# EAGLE design PCB-CMB-5-ETHERMEGA (EAGLE 7.3.0)

## Sheet 1 of 2
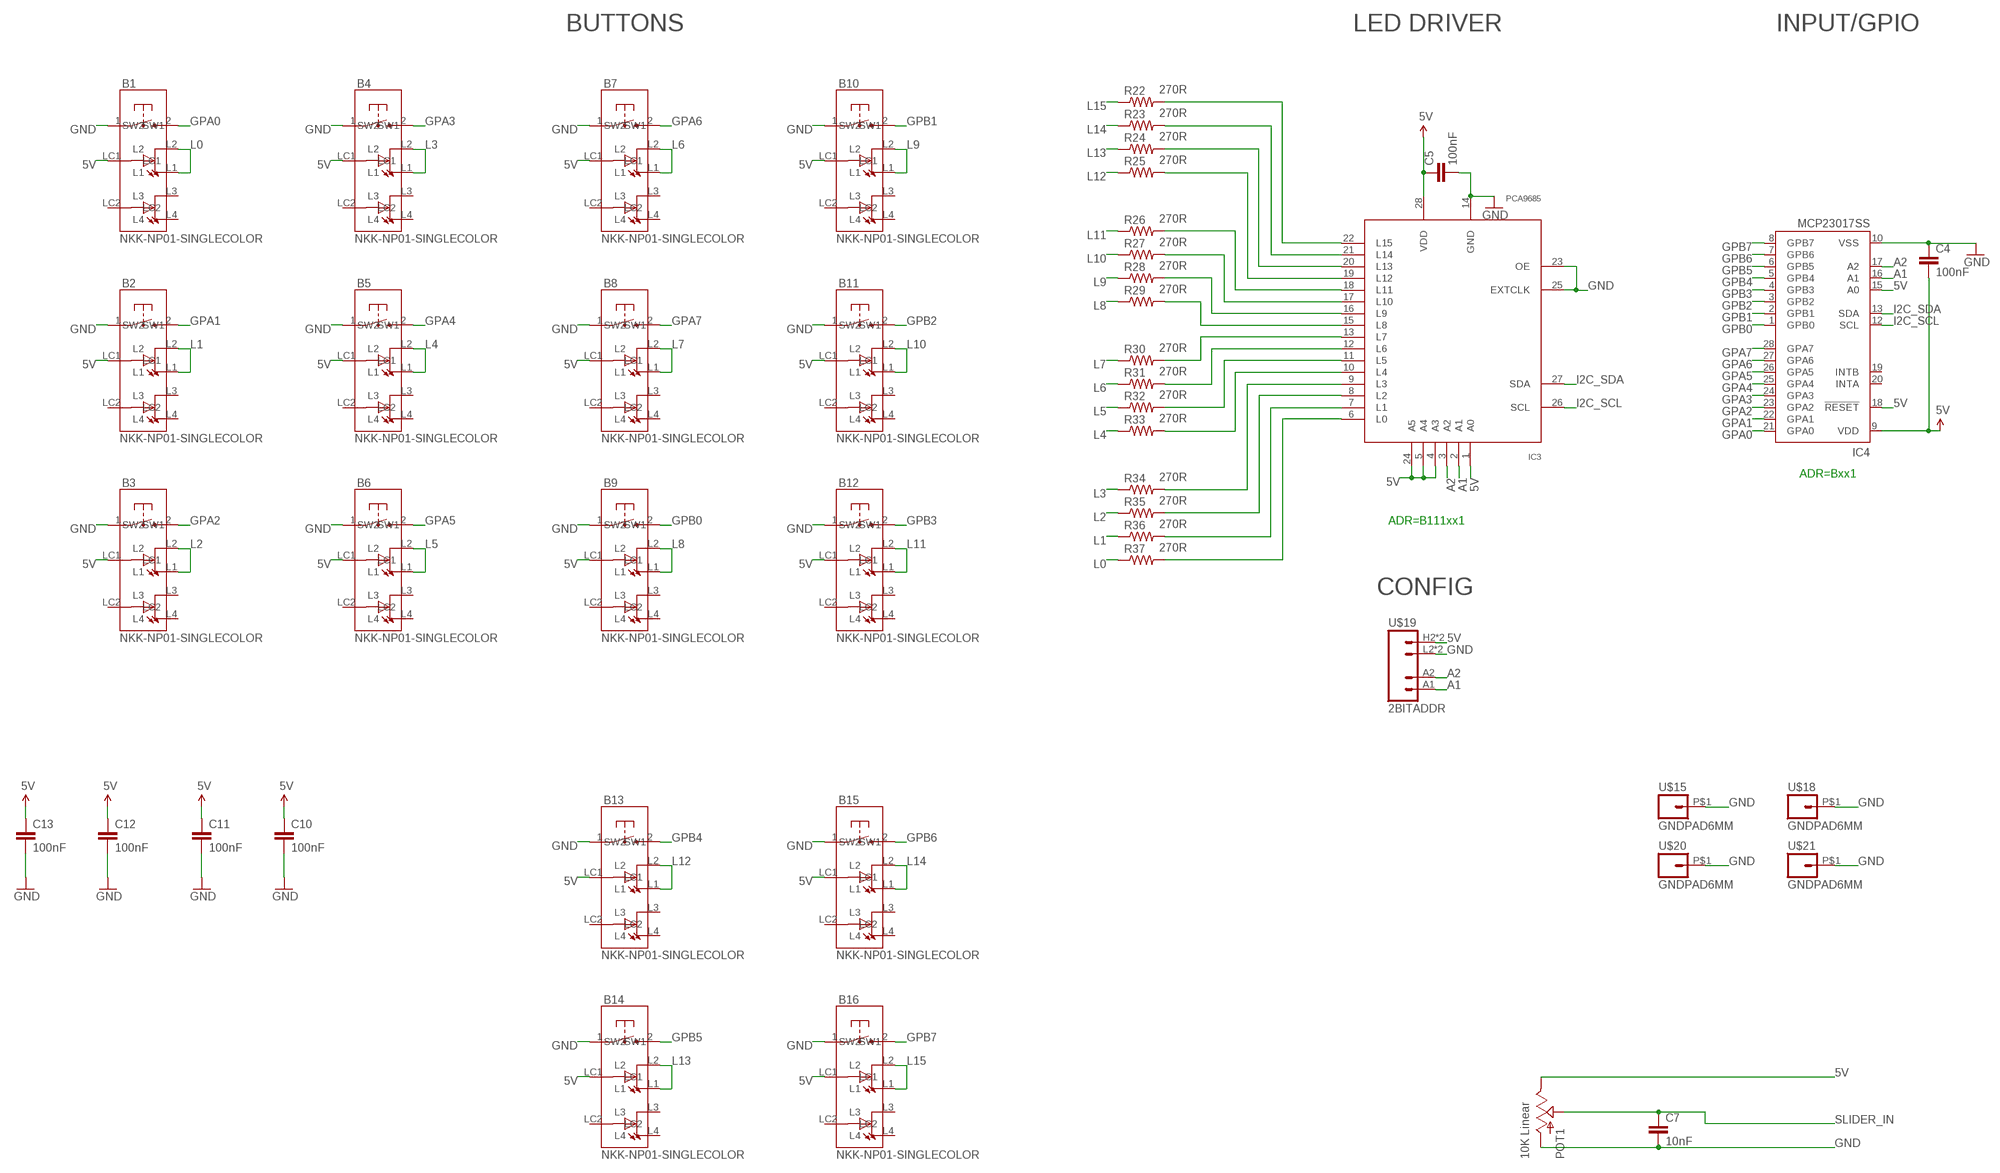
[diagram p0: schematic, sheet 1, part 1 of 2]
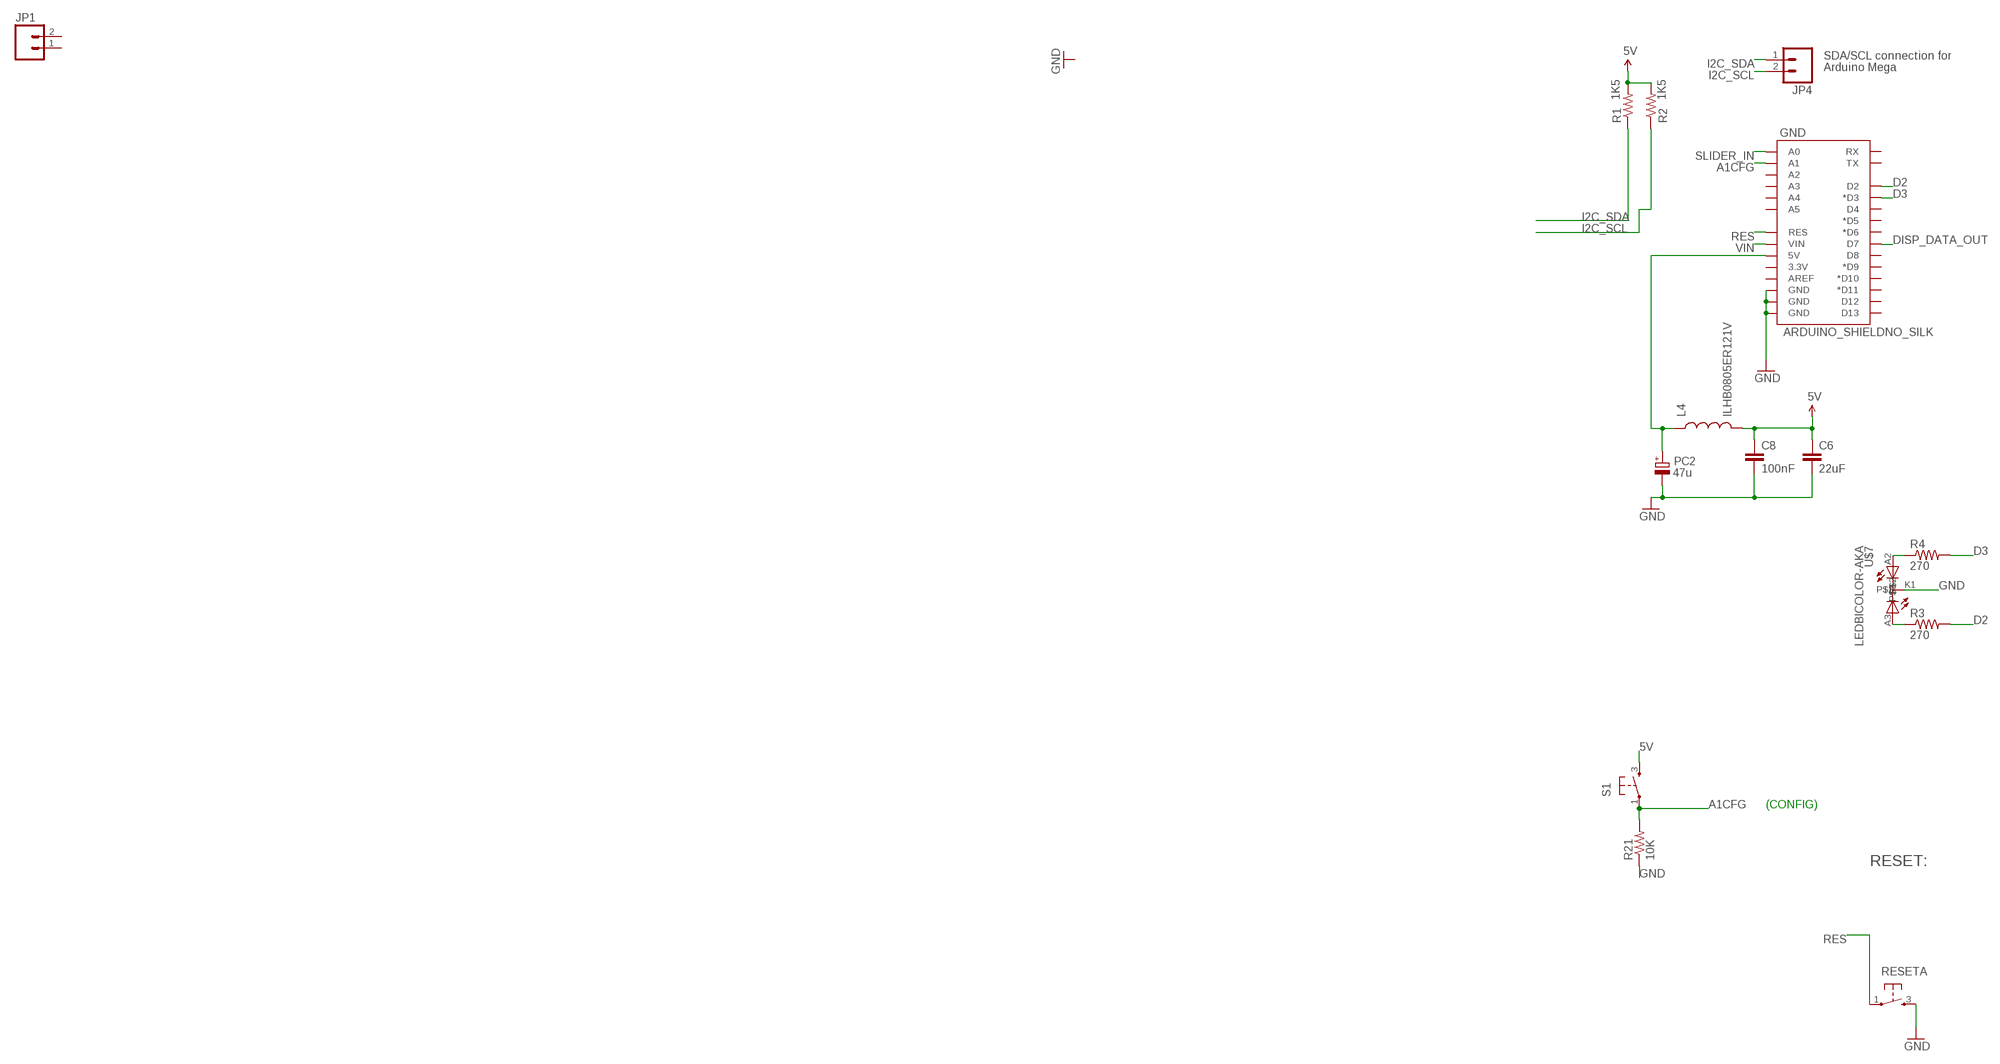
[diagram p1: schematic, sheet 1, part 2 of 2]

### Parts
B1  NKK-NP01-SINGLECOLOR  [NKK-NP01]
B2  NKK-NP01-SINGLECOLOR  [NKK-NP01]
B3  NKK-NP01-SINGLECOLOR  [NKK-NP01]
B4  NKK-NP01-SINGLECOLOR  [NKK-NP01]
B5  NKK-NP01-SINGLECOLOR  [NKK-NP01]
B6  NKK-NP01-SINGLECOLOR  [NKK-NP01]
B7  NKK-NP01-SINGLECOLOR  [NKK-NP01]
B8  NKK-NP01-SINGLECOLOR  [NKK-NP01]
B9  NKK-NP01-SINGLECOLOR  [NKK-NP01]
B10  NKK-NP01-SINGLECOLOR  [NKK-NP01]
B11  NKK-NP01-SINGLECOLOR  [NKK-NP01]
B12  NKK-NP01-SINGLECOLOR  [NKK-NP01]
B13  NKK-NP01-SINGLECOLOR  [NKK-NP01]
B14  NKK-NP01-SINGLECOLOR  [NKK-NP01]
B15  NKK-NP01-SINGLECOLOR  [NKK-NP01]
B16  NKK-NP01-SINGLECOLOR  [NKK-NP01]
C4  100nF  CAP0603-CAP  [0603-CAP]
C5  100nF  CAP0603-CAP  [0603-CAP]
C6  22uF  CAP0805  [0805]
C7  10nF  CAP0603-CAP  [0603-CAP]
C8  100nF  CAP0603-CAP  [0603-CAP]
C10  100nF  CAP0603-CAP  [0603-CAP]
C11  100nF  CAP0603-CAP  [0603-CAP]
C12  100nF  CAP0603-CAP  [0603-CAP]
C13  100nF  CAP0603-CAP  [0603-CAP]
GND  ARDUINO_SHIELDNO_SILK  [DUEMILANOVE_VIAS]
IC3  PCA9685  [TSSOP28]
IC4  MCP23017SS  [SSOP28]
JP1  M02PTH  [1X02]
JP4  M02PTH  [1X02]
L4  ILHB0805ER121V  INDUCTOR0805  [0805]
PC2  47u  CPOL-EUD  [PANASONIC_D]
POT1  10K Linear  SLIDER20  [SLIDER20]
R1  1K5  RESISTOR0603-RES  [0603-RES]
R2  1K5  RESISTOR0603-RES  [0603-RES]
R3  270  RESISTOR0603-RES  [0603-RES]
R4  270  RESISTOR0603-RES  [0603-RES]
R21  10K  RESISTOR0603-RES  [0603-RES]
R22  270R  RESISTOR0603-RES  [0603-RES]
R23  270R  RESISTOR0603-RES  [0603-RES]
R24  270R  RESISTOR0603-RES  [0603-RES]
R25  270R  RESISTOR0603-RES  [0603-RES]
R26  270R  RESISTOR0603-RES  [0603-RES]
R27  270R  RESISTOR0603-RES  [0603-RES]
R28  270R  RESISTOR0603-RES  [0603-RES]
R29  270R  RESISTOR0603-RES  [0603-RES]
R30  270R  RESISTOR0603-RES  [0603-RES]
R31  270R  RESISTOR0603-RES  [0603-RES]
R32  270R  RESISTOR0603-RES  [0603-RES]
R33  270R  RESISTOR0603-RES  [0603-RES]
R34  270R  RESISTOR0603-RES  [0603-RES]
R35  270R  RESISTOR0603-RES  [0603-RES]
R36  270R  RESISTOR0603-RES  [0603-RES]
R37  270R  RESISTOR0603-RES  [0603-RES]
RESETA  TAC_SWITCH  [PUSHBUTTON]
S1  TAC_SWITCH  [PUSHBUTTON]
U$7  LEDBICOLOR-AKA  [LED5MM-BICOLOR]
U$15  GNDPAD6MM  [3.2MMPAD6MM]
U$18  GNDPAD6MM  [3.2MMPAD6MM]
U$19  2BITADDR  [2BITADDR]
U$20  GNDPAD6MM  [3.2MMPAD6MM]
U$21  GNDPAD6MM  [3.2MMPAD6MM]

### Nets
5V [Power]: B1.LC1 B2.LC1 B3.LC1 B4.LC1 B5.LC1 B6.LC1 B7.LC1 B8.LC1 B9.LC1 B10.LC1 B11.LC1 B12.LC1 B13.LC1 B14.LC1 B15.LC1 B16.LC1 C4.2 C5.1 C6.1 C8.1 C10.1 C11.1 C12.1 C13.1 IC3.1(A0) IC3.4(A3) IC3.5(A4) IC3.24(A5) IC3.28(VDD) IC4.9(VDD) IC4.15(A0) IC4.18(!RESET) L4.2 POT1.1(E) R1.2 R2.2 S1.3 U$19.H2(VCC) U$19.H3(VCC)
A1: IC3.2(A1) IC4.16(A1) U$19.A1
A1CFG: GND.A1 R21.2 S1.1
A2: IC3.3(A2) IC4.17(A2) U$19.A2
ARD_5V [Power]: GND.5V L4.1 PC2.+
D2: GND.D2 R3.2
D3: GND.D3(*D3) R4.2
DISP_DATA_OUT: GND.D7
GND [Power]: B1.1(SW1) B2.1(SW1) B3.1(SW1) B4.1(SW1) B5.1(SW1) B6.1(SW1) B7.1(SW1) B8.1(SW1) B9.1(SW1) B10.1(SW1) B11.1(SW1) B12.1(SW1) B13.1(SW1) B14.1(SW1) B15.1(SW1) B16.1(SW1) C4.1 C5.2 C6.2 C7.2 C8.2 C10.2 C11.2 C12.2 C13.2 GND.GND@0(GND) GND.GND@1(GND) GND.GND@2(GND) IC3.14(GND) IC3.23(OE) IC3.25(EXTCLK) IC4.10(VSS) PC2.- POT1.3(A) R21.1 RESETA.3 U$7.K1 U$15.P$1 U$18.P$1 U$19.L2(GND) U$19.L3(GND) U$20.P$1 U$21.P$1
GPA0: B1.2(SW2) IC4.21(GPA0)
GPA1: B2.2(SW2) IC4.22(GPA1)
GPA2: B3.2(SW2) IC4.23(GPA2)
GPA3: B4.2(SW2) IC4.24(GPA3)
GPA4: B5.2(SW2) IC4.25(GPA4)
GPA5: B6.2(SW2) IC4.26(GPA5)
GPA6: B7.2(SW2) IC4.27(GPA6)
GPA7: B8.2(SW2) IC4.28(GPA7)
GPB0 [Power]: B9.2(SW2) IC4.1(GPB0)
GPB1: B10.2(SW2) IC4.2(GPB1)
GPB2: B11.2(SW2) IC4.3(GPB2)
GPB3: B12.2(SW2) IC4.4(GPB3)
GPB4: B13.2(SW2) IC4.5(GPB4)
GPB5: B14.2(SW2) IC4.6(GPB5)
GPB6: B15.2(SW2) IC4.7(GPB6)
GPB7: B16.2(SW2) IC4.8(GPB7)
I2C_SCL: IC3.26(SCL) IC4.12(SCL) JP4.2 R2.1
I2C_SDA: IC3.27(SDA) IC4.13(SDA) JP4.1 R1.1
L0: B1.L1 B1.L2 R37.1
L1: B2.L1 B2.L2 R36.1
L2: B3.L1 B3.L2 R35.1
L3: B4.L1 B4.L2 R34.1
L4: B5.L1 B5.L2 R33.1
L5: B6.L1 B6.L2 R32.1
L6: B7.L1 B7.L2 R31.1
L7: B8.L1 B8.L2 R30.1
L8: B9.L1 B9.L2 R29.1
L9: B10.L1 B10.L2 R28.1
L10: B11.L1 B11.L2 R27.1
L11: B12.L1 B12.L2 R26.1
L12: B13.L1 B13.L2 R25.1
L13: B14.L1 B14.L2 R24.1
L14: B15.L1 B15.L2 R23.1
L15: B16.L1 B16.L2 R22.1
N$2: IC3.13(L7) R30.2
N$7: R4.1 U$7.A2
N$11: R3.1 U$7.A3
N$19: IC3.12(L6) R31.2
N$23: IC3.11(L5) R32.2
N$31: IC3.10(L4) R33.2
N$58: IC3.9(L3) R34.2
N$59: IC3.8(L2) R35.2
N$67: IC3.7(L1) R36.2
N$74: IC3.6(L0) R37.2
N$75: IC3.15(L8) R29.2
N$76: IC3.16(L9) R28.2
N$77: IC3.17(L10) R27.2
N$78: IC3.18(L11) R26.2
N$79: IC3.19(L12) R25.2
N$80: IC3.20(L13) R24.2
N$81: IC3.21(L14) R23.2
N$82: IC3.22(L15) R22.2
RES: GND.RES RESETA.1
SLIDER_IN: C7.1 GND.A0 POT1.2A(S)
VIN: GND.VIN
Unconnected: B1.L3 B1.L4 B1.LC2 B2.L3 B2.L4 B2.LC2 B3.L3 B3.L4 B3.LC2 B4.L3 B4.L4 B4.LC2 B5.L3 B5.L4 B5.LC2 B6.L3 B6.L4 B6.LC2 B7.L3 B7.L4 B7.LC2 B8.L3 B8.L4 B8.LC2 B9.L3 B9.L4 B9.LC2 B10.L3 B10.L4 B10.LC2 B11.L3 B11.L4 B11.LC2 B12.L3 B12.L4 B12.LC2 B13.L3 B13.L4 B13.LC2 B14.L3 B14.L4 B14.LC2 B15.L3 B15.L4 B15.LC2 B16.L3 B16.L4 B16.LC2 GND.3.3V GND.A2 GND.A3 GND.A4 GND.A5 GND.AREF GND.D4 GND.D5(*D5) GND.D6(*D6) GND.D8 GND.D9(*D9) GND.D10(*D10) GND.D11(*D11) GND.D12 GND.D13 GND.RX GND.TX IC4.19(INTB) IC4.20(INTA) JP1.1 JP1.2

### Notes on the sheet
- BUTTONS | LED DRIVER | INPUT/GPIO
- ADR=Bxx1
- ADR=B111xx1
- CONFIG
- SDA/SCL connection for
- Arduino Mega
- (CONFIG)
- RESET:

## Sheet 2 of 2

## Library data of the parts
B1-B16 = SKAARHOJ:NKK-NP01-SINGLECOLOR
C4-C8 C10-C13 = SparkFun:CAP: Capacitor Standard 0603 ceramic capacitor, and 0.1" leaded capacitor.
GND = SparkFun:ARDUINO_SHIELD
IC3 = wsmith:PCA9685
IC4 = microchip:MCP23017: http://ww1.microchip.com/downloads/en/DeviceDoc/21952a.pdf Source: http://ww1.microchip.com/downloads/en/DeviceDoc/21952a.pdf; MF: MICROCHIP; MPN: MCP23017-E/SS; OC_FARNELL: 1467674; OC_NEWARK: 31K2960
JP1 JP4 = SparkFun:M02: Header 2 Standard 2-pin 0.1" header. Use with straight break away headers (SKU : PRT-00116), right angle break away headers (PRT-00553), swiss pins (PRT-00743), machine pins (PRT-00117), and female headers (PRT-00115). Molex polarized connector foot print use with SKU : PRT-08233 with associated crimp pins and housings.
L4 = SparkFun:INDUCTOR: Inductors Basic Inductor/Choke - 0603 and 1206. Footprints are not proven and vary greatly between part numbers.
PC2 = rcl:CPOL-EU: POLARIZED CAPACITOR, European symbol
POT1 = SKAARHOJ:SLIDER
R1-R4 R21-R37 = SparkFun:RESISTOR: Resistor Basic schematic elements and footprints for 0603, 1206, and PTH resistors.
RESETA S1 = SKAARHOJ:TAC_SWITCH: Momentary Switch Button commonly used for reset or general input. Spark Fun Electronics SKU : COM-00097
U$7 = SKAARHOJ:LEDBICOLOR-AKA
U$15 U$18 U$20 U$21 = SKAARHOJ:GNDPAD
U$19 = SKAARHOJ:2BITADDR

## Net classes
0 default: width 0.203 mm, drill 0.305 mm, clearance 0.203 mm
1 Power: width 0.406 mm, drill 0.457 mm, clearance 0.203 mm
2 RELAY LINES: width 0.305 mm, drill 0.305 mm, clearance 0.203 mm
3 INput lines: width 0.203 mm, drill 0.305 mm, clearance 0.203 mm

## Board
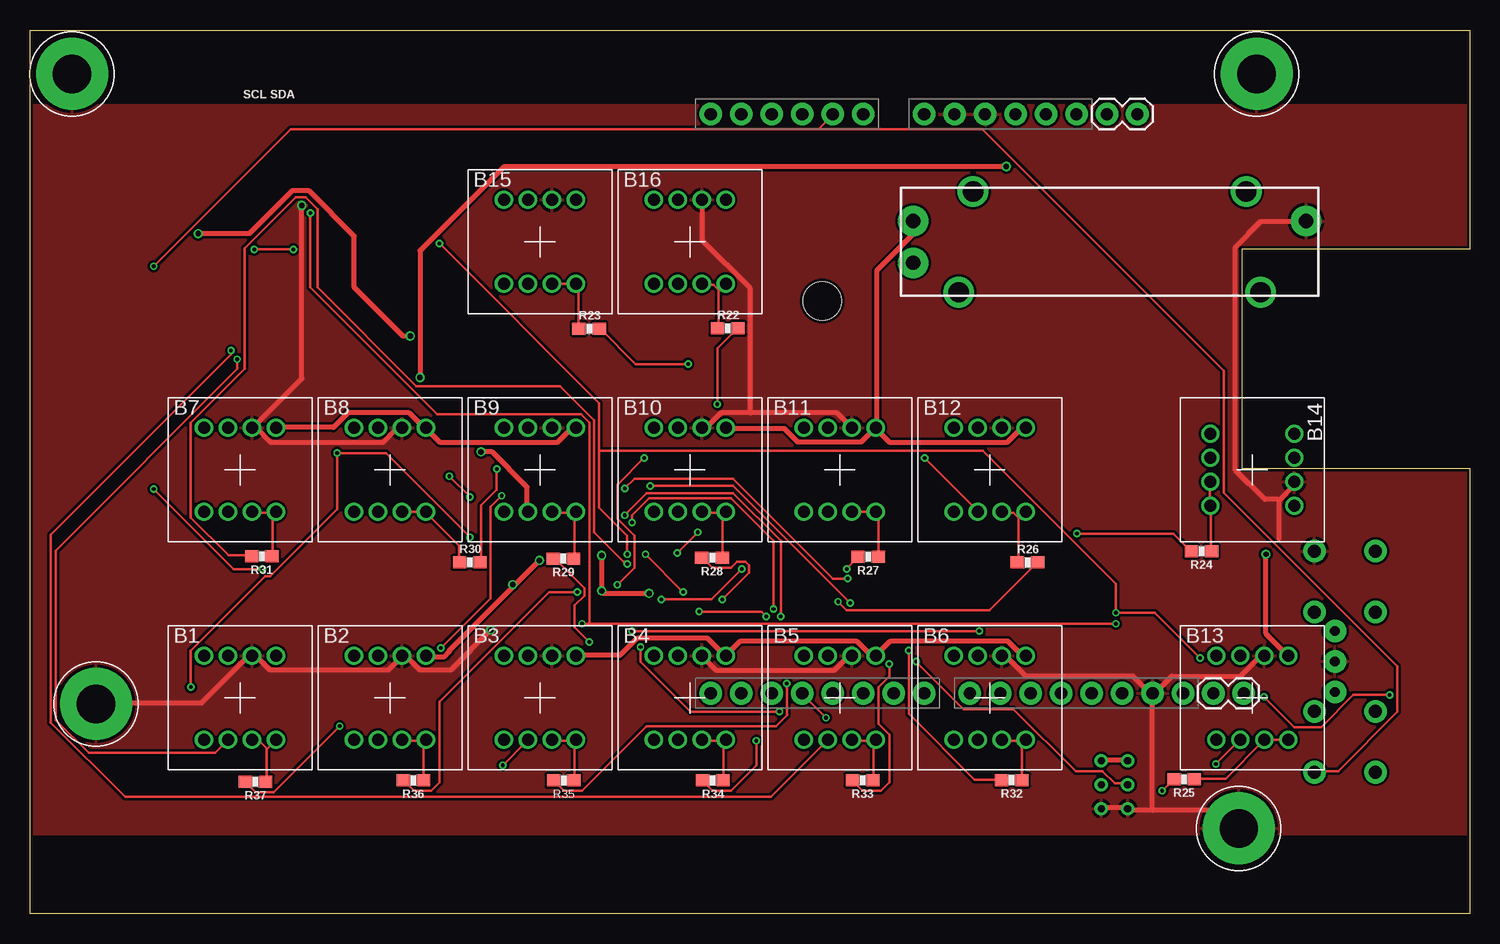
[diagram p2: board, top side]
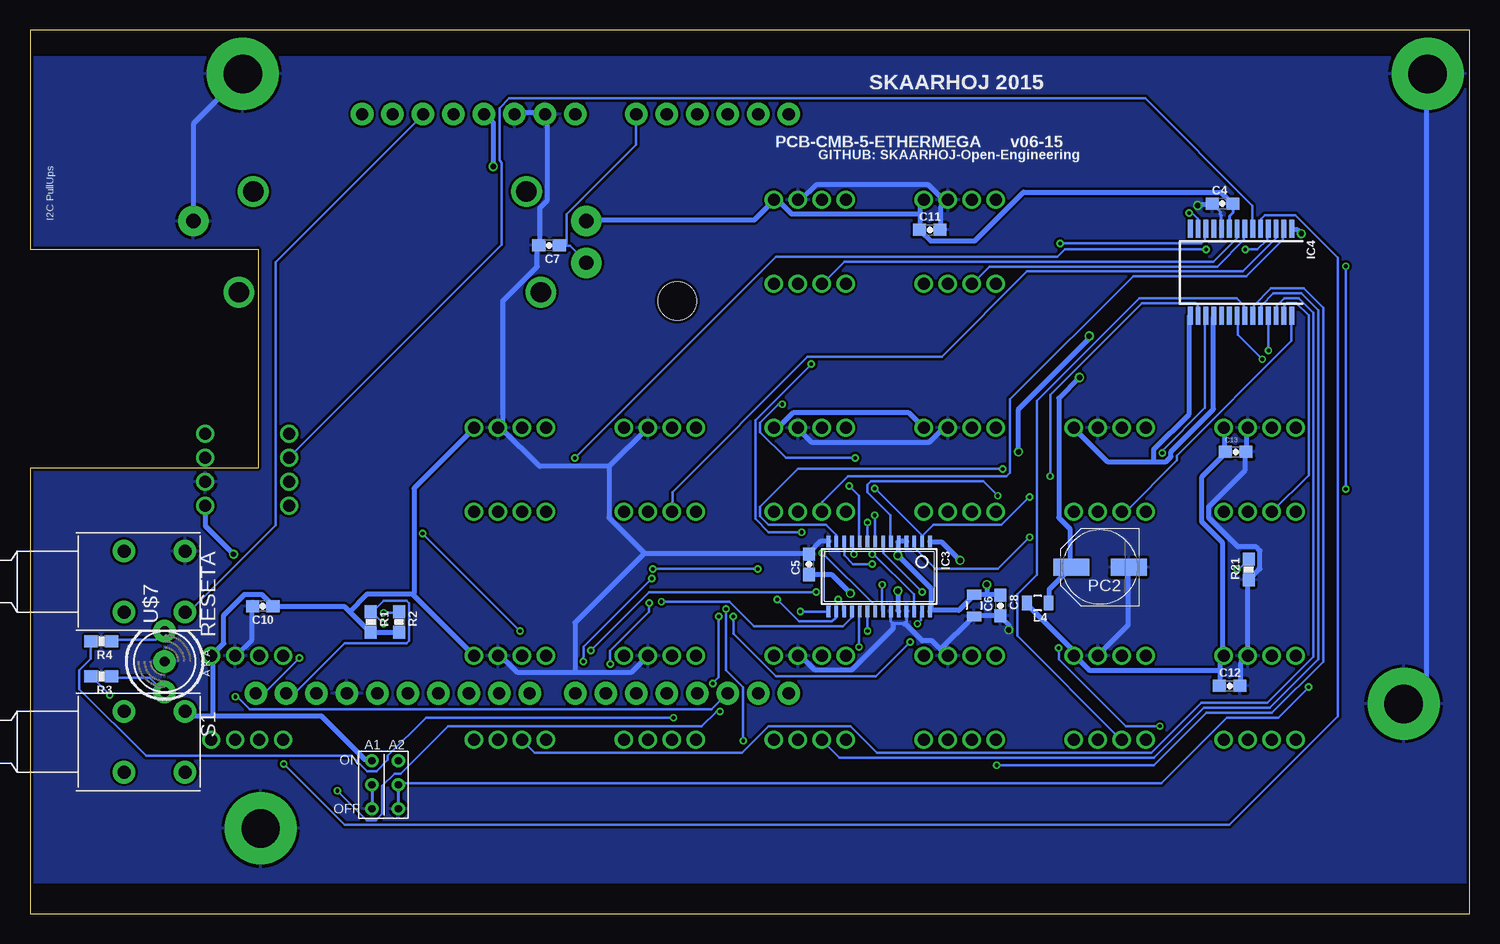
[diagram p3: board, bottom side, seen from below]

Size 120 x 73.66 mm. Coordinates in mm from the lower left corner, seen from the top.
Outline: 0,0 0,73.66 120,73.66 120,55.39 101,55.39 101,37.15 120,37.15 120,0 0,0
Copper layers (1*16): Top 0.035mm / dielectric 1.5mm / Bottom 0.035mm
Design rules "Fusion_eagle_rule_v1.1": minimum track width 6mil, minimum drill 12mil, track to track 6mil, track to pad 6mil, pad to pad 6mil, via to via 6mil, smd to smd 0mil, copper to edge 10mil, drill to drill 10mil, minimum pad ring 10mil, minimum via ring 6mil, stop-mask expansion 2mil, vias tented up to drill 100mil, thermal gap 10mil
Holes 3.2 mm at 66.04,51.07
tRestrict: area 0,0 to 120,6.5; area 0,67.5 to 120,74
bRestrict: area 0,71.5 to 120,74; area 0,0 to 120,2.5

### Footprints (pad centres in the part's own frame; a part is rotated, then mirrored left to right if it is on the bottom)
NKK-NP01 = drill 1: 1 1,3.5; 2 -1,-3.5; L1 3,-3.5; L2 1,-3.5; L3 -1,3.5; L4 -3,3.5; LC1 3,3.5; LC2 -3,-3.5
0603-CAP = smd 1.1 x 1: 1 -0.85,0; 2 0.85,0
0805 = smd 0.8 x 1.2: 1 -0.9,0; 2 0.9,0
DUEMILANOVE_VIAS = drill 1.016 pad 1.88: 3.3V 50.8,13.97; 5V 50.8,16.51; A0 50.8,29.21; A1 50.8,31.75; A2 50.8,34.29; A3 50.8,36.83; A4 50.8,39.37; A5 50.8,41.91; AREF 2.54,2.54; D2 2.54,36.83; D3 2.54,34.29; D4 2.54,31.75; D5 2.54,29.21; D6 2.54,26.67; D7 2.54,24.13; D8 2.54,20.32; D9 2.54,17.78; D10 2.54,15.24; D11 2.54,12.7; D12 2.54,10.16; D13 2.54,7.62; GND@0 50.8,19.05; GND@1 50.8,21.59; GND@2 2.54,5.08; RES 50.8,11.43; RX 2.54,41.91; TX 2.54,39.37; VIN 50.8,24.13
TSSOP28 = smd 0.305 x 0.991: 1 -4.225,-2.918; 2 -3.575,-2.918; 3 -2.925,-2.918; 4 -2.275,-2.918; 5 -1.625,-2.918; 6 -0.975,-2.918; 7 -0.325,-2.918; 8 0.325,-2.918; 9 0.975,-2.918; 10 1.625,-2.918; 11 2.275,-2.918; 12 2.925,-2.918; 13 3.575,-2.918; 14 4.225,-2.918; 15 4.225,2.918; 16 3.575,2.918; 17 2.925,2.918; 18 2.275,2.918; 19 1.625,2.918; 20 0.975,2.918; 21 0.325,2.918; 22 -0.325,2.918; 23 -0.975,2.918; 24 -1.625,2.918; 25 -2.275,2.918; 26 -2.925,2.918; 27 -3.575,2.918; 28 -4.225,2.918
SSOP28 = smd 0.4 x 1.5: 1 -4.225,-3.625; 2 -3.575,-3.625; 3 -2.925,-3.625; 4 -2.275,-3.625; 5 -1.625,-3.625; 6 -0.975,-3.625; 7 -0.325,-3.625; 8 0.325,-3.625; 9 0.975,-3.625; 10 1.625,-3.625; 11 2.275,-3.625; 12 2.925,-3.625; 13 3.575,-3.625; 14 4.225,-3.625; 15 4.225,3.625; 16 3.575,3.625; 17 2.925,3.625; 18 2.275,3.625; 19 1.625,3.625; 20 0.975,3.625; 21 0.325,3.625; 22 -0.325,3.625; 23 -0.975,3.625; 24 -1.625,3.625; 25 -2.275,3.625; 26 -2.925,3.625; 27 -3.575,3.625; 28 -4.225,3.625
1X02 = drill 1.016 pad 1.88: 1 0,0; 2 2.54,0
PANASONIC_D = smd 3 x 1.4: + 2.4,0; - -2.4,0
SLIDER20 = drill 1.194 pad 2.54: 1 -16.383,1.74; 2A -16.383,-1.74; 3 16.383,1.74 | drill 1.702: P$1 -11.392,4.191; P$2 11.392,4.191; P$3 12.598,-4.191; P$4 -12.598,-4.191
0603-RES = smd 1.1 x 1: 1 -0.85,0; 2 0.85,0
PUSHBUTTON = drill 1.1 pad 1.88: 1 2.54,2.54; 2 2.54,-2.54; 3 -2.54,2.54; 4 -2.54,-2.54
LED5MM-BICOLOR = drill 0.813 pad 1.88: A2 2.54,0; A3 -2.54,0; K1 0,0
3.2MMPAD6MM = drill 3.2 pad 6: P$1 0,0
2BITADDR = drill 0.6: A1 0,0; A2 2.2,0; H2 0,2; H3 2.2,2; L2 0,-2; L3 2.2,-2

### Placement (x,y rotation side)
B1  17.5,18 0 top
B2  30,18 0 top
B3  42.5,18 0 top
B4  55,18 0 top
B5  67.5,18 0 top
B6  80,18 0 top
B7  17.5,37 0 top
B8  30,37 0 top
B9  42.5,37 0 top
B10  55,37 0 top
B11  67.5,37 0 top
B12  80,37 0 top
B13  101.88,18 0 top
B14  101.88,37 270 top
B15  42.5,56 0 top
B16  55,56 0 top
C4  20.59,59.2 0 bottom
C5  55.07,29.13 90 bottom
C6  41.3,25.7 270 bottom
C7  76.73,55.71 180 bottom
C8  39.1,25.7 270 bottom
C10  100.6,25.64 180 bottom
C11  45,57 0 bottom
C12  20,19 0 bottom
C13  19.5,38.5 0 bottom
GND  98.66,15.85 90 top
IC3  49.21,28.12 180 bottom
IC4  19.05,53.46 180 bottom
JP1  92.31,66.65 180 top
JP4  98.64,18.39 0 top
L4  36,25.9 180 bottom
PC2  30.8,28.9 180 bottom
POT1  90,56 0 top
R1  91.58,24.33 270 bottom
R2  89.22,24.33 270 bottom
R3  114.06,19.79 180 bottom
R4  114.06,22.71 180 bottom
R21  18.41,28.72 90 bottom
R22  58.16,48.8 0 top
R23  46.61,48.77 0 top
R24  97.65,30.23 180 top
R25  96.22,11.23 180 top
R26  83.15,29.29 0 top
R27  69.88,29.75 180 top
R28  56.86,29.68 180 top
R29  44.47,29.61 180 top
R30  36.66,29.3 0 top
R31  19.32,29.8 180 top
R32  81.84,11.16 180 top
R33  69.41,11.14 180 top
R34  56.93,11.12 180 top
R35  44.48,11.12 180 top
R36  31.96,11.12 180 top
R37  18.81,11 180 top
RESETA  109.61,27.69 270 bottom
S1  109.61,14.35 270 bottom
U$7  108.78,21.04 90 bottom
U$15  100.77,7.12 0 top
U$18  102.26,70 0 top
U$19  91.5,10.77 0 bottom
U$20  5.5,17.5 0 top
U$21  3.5,70 0 top

### Tracks (layer width: path | path; a pad name or v marks a point on that pad's centre or on a via)
5V  (via drill 0.46)
  Top 0.406: U$19.H3 89.31,12.8 91.44,12.8 U$19.H2 | 104.95,21.44 B13.LC1 104.75,21.64 103.02,23.37 v103.02,29.97 | B3.LC1 45.52,21.54 49.17,21.54 50.6,22.96 56.49,22.96 57.91,21.54 B4.LC1 58.12,21.64 59.23,22.76 68.89,22.76 70.1,21.54 70.41,21.54 B5.LC1 70.61,21.64 71.73,22.76 81.48,22.76 82.7,21.54 82.91,21.54 B6.LC1 | v47.65,29.87 v47.65,26.92 47.85,26.72 v51.61,26.72 | 40.34,27.33 34.95,21.95 34.95,21.84 34.54,21.44 33.02,21.44 B2.LC1 | 40.34,27.33 v42.47,29.46 | v40.23,27.43 40.34,27.33 | B10.LC1 58.01,40.44 62.89,40.44 64.01,39.32 69.29,39.32 70.41,40.44 B11.LC1 | B12.LC1 82.91,40.44 82.6,40.44 81.48,39.32 71.63,39.32 70.61,40.34 B11.LC1 | B9.LC1 45.41,40.44 45.11,40.44 43.99,39.32 34.14,39.32 33.02,40.44 B8.LC1 32.82,40.54 31.6,41.76 26.52,41.76 25.3,40.54 20.52,40.54 B7.LC1 | POT1.1 73.56,57.71 73.56,56.59 70.61,53.65 70.61,40.64 B11.LC1
  Bottom 0.254: C4.2 19.74,58.42 20.02,58.14 20.02,57.09 IC4.9
  Bottom 0.406: R2.2 89.31,23.47 91.54,23.47 R1.2 91.75,23.57 93.37,25.2 | 93.37,25.2 93.78,25.6 99.67,25.6 C10.1 99.87,25.81 100.69,26.62 102.11,26.62 103.83,24.89 103.83,22.55 104.85,21.54 B13.LC1 104.78,21.43 104.78,16.51 | v103.02,29.97 105.36,32.31 105.36,33.93 B14.LC1 | 93.37,25.2 91.95,26.62 88.09,26.62 | 88.09,26.62 83.01,21.54 B6.LC1 | 45.82,58.32 45.82,59.13 45.52,59.44 B15.LC1 | 45.82,58.32 45.82,57.1 C11.1 45.72,56.9 44.91,56.08 41.25,56.08 37.19,60.15 20.73,60.15 19.81,59.23 C4.2 | 45.82,58.32 56.49,58.32 57.61,59.44 57.91,59.44 B16.LC1 58.12,59.33 59.64,57.81 73.56,57.81 POT1.1 | 40.23,26.62 41.15,26.62 C6.1 41.35,26.52 42.57,25.3 44.91,25.3 IC3.28 44.91,25.5 44.91,27.13 v47.65,29.87 47.65,30.99 IC3.5 47.45,31.09 46.94,31.09 IC3.4 | 40.23,26.62 39.12,26.62 C8.1 | v47.65,26.92 47.65,25.3 IC3.24 | v51.61,26.72 53.14,28.25 55.07,28.25 C5.1 | 20.83,20.32 20.83,21.13 20.52,21.44 B1.LC1 20.62,21.64 20.62,30.99 22.35,32.72 22.35,36.37 20.42,38.3 C13.1 20.42,38.51 20.42,40.44 B7.LC1 | 20.83,20.32 20.83,19.1 C12.1 | v42.47,29.46 43.99,30.99 44.91,30.99 IC3.1 | L4.2 36.88,25.81 33.02,21.95 33.02,21.54 B2.LC1 32.82,21.44 31.7,20.32 20.83,20.32 | v40.23,27.43 40.23,26.62 | 26.31,37.69 30.18,37.69 32.92,40.44 B8.LC1 | 26.31,37.69 25.3,37.69 24.89,38.1 24.89,38.51 21.34,42.06 21.34,49.78 IC4.18 | 26.31,37.69 26.31,38.71 23.37,41.66 23.37,49.78 IC4.15 | B10.LC1 57.91,40.54 57.61,40.54 56.39,41.76 46.74,41.76 45.52,40.54 B9.LC1 | 88.09,26.62 87.99,26.72 87.99,35.46 83.01,40.44 B12.LC1 | 104.78,16.51 106.68,16.51 107,16.83 S1.3 | 104.78,16.51 95.73,16.51 92.08,12.86 91.6,12.86 U$19.H2
A1  (via drill 0.3)
  Top 0.203: v34.95,36.47 v36.68,34.75 | v73.86,21.03 77.83,17.07 81.99,17.07 87.17,11.89 89.41,11.89 90.42,10.87 91.44,10.87 U$19.A1 | v68.17,27.94 66.95,27.94 58.62,36.27 50.39,36.27 v49.58,35.46
  Bottom 0.203: 45.62,31.5 45.62,31.09 IC3.2 45.62,31.5 | 45.62,31.5 44.7,32.41 39.01,32.41 v36.68,34.75 | v34.95,36.47 34.95,43.28 27.33,50.9 22.86,50.9 22.66,50.7 22.66,49.89 IC4.16 | v73.86,21.03 73.86,22.25 v68.17,27.94 | 45.62,31.5 v49.58,35.46
  Bottom 0.254: U$19.A1 91.5,8.8 91.54,8.76
A1CFG  (via drill 0.3)
  Top 0.203: v19.37,28.73 16.99,28.73 v10.32,35.4 | v10.32,53.98 21.75,65.41 65.72,65.41 | 65.72,65.41 66.83,66.52 GND.A1 | 65.72,65.41 79.38,65.41 99.54,45.24 99.54,35.08 113.98,20.64 113.98,16.83 109.06,11.91 107.16,11.91 S1.1
  Bottom 0.203: v19.37,28.73 19.21,28.73 18.41,29.53 R21.2 | v10.32,53.98 v10.32,35.4
A2  (via drill 0.3)
  Top 0.203: v36.68,31.39 29.67,38.41 v25.6,38.41 25.6,33.73 20.02,28.14 19.61,28.14 13.41,21.95 v13.41,18.9
  Bottom 0.203: v36.68,31.39 39.32,28.75 44.5,28.75 46.23,30.48 46.23,30.99 IC3.3 | v25.6,38.41 25.6,38.61 22.05,42.16 22.05,49.78 IC4.17 | v13.41,18.9 15.95,16.36 20.22,16.36 25.7,10.87 89.2,10.87 U$19.A2
  Bottom 0.254: U$19.A2 89.3,8.77 89.33,8.74
ARD_5V  (via drill 0.46)
  Top 0.406: v32.51,44.7 32.51,55.27 39.52,62.28 v81.38,62.28
  Bottom 0.406: L4.1 35.05,25.91 35.05,27.03 33.22,28.85 PC2.+ 33.33,29.06 33.33,32.11 34.24,33.02 34.24,42.98 v32.51,44.7 | v81.38,62.28 81.38,65.94 82.09,66.65 GND.5V
D2  (via drill 0.3)
  Top 0.203: v113.35,18.26 110.33,18.26 107.63,15.56 105.41,15.56 v102.87,18.1
  Bottom 0.203: 102.8,18.17 101.7,17.07 63.2,17.07 61.87,18.39 GND.D2 | 102.8,18.17 102.82,18.19 | v113.35,18.26 114.78,19.68 R3.2 | v102.87,18.1 102.8,18.17
D3  (via drill 0.3)
  Top 0.203: v66.36,16.35 64.45,18.26 GND.D3
  Bottom 0.203: v66.36,16.35 87,16.35 90.17,13.18 90.17,12.86 91.12,11.91 91.92,11.91 93.19,13.18 110.33,13.18 115.89,18.73 115.89,20.32 114.94,21.27 114.94,22.7 R4.2
GND  (via drill 0.46)
  Top 0.406: v22.66,59.03 22.66,44.6 18.59,40.54 B7.1 18.8,40.54 20.02,39.32 29.46,39.32 30.58,40.44 30.99,40.44 B8.1 | U$20.P$1 5.59,17.58 14.33,17.58 18.29,21.54 B1.1 18.59,21.44 18.9,21.44 20.02,20.32 29.87,20.32 30.99,21.44 B2.1 31.19,21.44 31.39,21.44 32.51,20.32 35.05,20.32 v38.41,23.67 | B5.1 68.48,21.44 68.17,21.44 67.06,20.32 57.2,20.32 56.08,21.44 B4.1 | 60.05,41.76 67.26,41.76 68.48,40.54 B11.1 | 60.05,41.76 57.61,41.76 56.39,40.54 56.08,40.54 B10.1 | 60.05,41.76 60.05,52.12 56.08,56.08 56.08,59.44 B16.1 | 104.14,34.44 105.36,35.66 105.36,35.97 B14.1 | 104.14,31.29 104.14,34.44 | U$19.L3 89.31,8.84 91.44,8.84 U$19.L2 91.64,8.64 93.57,8.64 | 93.57,8.64 99.26,8.64 100.69,7.21 U$15.P$1 | 93.57,8.64 GND.GND@2 | B13.1 102.82,21.44 102.51,21.44 100.89,19.81 95.2,19.81 93.78,18.39 GND.GND@2 | POT1.3 106.38,57.71 102.62,57.71 100.48,55.58 100.48,36.98 102.92,34.54 104.04,34.54 104.14,34.44 | B6.1 81.08,21.44 81.38,21.44 83.01,19.81 91.95,19.81 93.37,18.39 GND.GND@2
  Bottom 0.254: IC4.10 20.68,58.19 20.75,58.27 20.75,58.51 C4.1 | IC3.25 46.94,24.36 47.12,24.18 48.03,24.18 48.08,24.23 48.11,24.23 48.23,24.36 IC3.23 | IC3.23
  Bottom 0.406: B7.1 18.59,40.44 18.59,38.51 C13.2 18.69,38.3 18.69,36.98 21.74,33.93 21.74,33.02 19.3,30.58 17.78,30.58 17.48,30.28 17.48,28.75 18.29,27.94 R21.1 18.49,27.84 18.49,21.64 B1.1 18.59,21.44 19.1,20.93 19.1,19.1 C12.2 | v22.66,59.03 22.55,59.13 21.54,59.13 C4.1 | PC2.- 28.45,28.85 28.45,24.08 30.99,21.54 B2.1 | U$21.P$1 3.56,69.9 3.56,19.51 5.49,17.58 U$20.P$1 | 44.09,22.05 43.59,21.54 B3.1 | 44.09,22.05 44.81,22.76 45.62,22.76 47.04,24.18 47.12,24.18 | 44.09,22.05 41.45,24.69 C6.2 41.25,24.89 39.12,24.89 C8.2 39.01,24.69 38.41,24.08 v38.41,23.67 | B4.1 55.98,21.44 55.68,21.44 54.56,20.32 51.51,20.32 48.06,23.77 48.06,24.08 48.03,24.18 | 74.57,20.12 69.9,20.12 68.58,21.44 B5.1 | 74.57,20.12 79.35,20.12 80.67,21.44 80.97,21.44 B6.1 | GND.GND@0 79.55,66.75 77.22,66.75 GND.GND@1 77.01,66.65 76.91,66.55 76.91,59.44 77.52,58.83 77.52,55.78 C7.2 77.72,55.58 77.72,53.95 80.57,51.1 80.57,40.54 B12.1 80.97,40.44 80.67,40.44 77.52,37.29 71.73,37.29 | C11.2 44.09,57.1 44.09,58.93 43.59,59.44 B15.1 43.79,59.44 45.11,60.76 54.46,60.76 55.68,59.54 55.98,59.54 B16.1 | B9.1 43.59,40.44 43.89,40.44 45.01,39.32 54.86,39.32 55.98,40.44 B10.1 | IC3.14 53.44,31.09 54.05,31.09 55.07,30.07 C5.2 55.27,30.07 68.78,30.07 | 68.78,30.07 71.73,33.02 71.73,37.29 | 71.73,37.29 68.58,40.44 B11.1 | 74.57,20.12 74.57,24.28 68.78,30.07 | POT1.3 106.38,57.81 106.38,65.84 102.31,69.9 U$18.P$1 | C10.2 101.5,25.6 101.5,22.86 102.82,21.54 B13.1
  pour Top: 0,0 120.28,0 120.28,74.4 0,74.4
  pour Bottom: 0,0 120.28,0 120.28,74.4 0,74.4
GPA0  (via drill 0.3)
  Top 0.203: v17.27,46.23 17.27,45.41 2.13,30.28 2.13,16.15 4.88,13.41 15.44,13.41 16.46,14.43 B1.2
  Bottom 0.203: v17.27,46.23 19.3,48.26 19.3,49.78 IC4.21
GPA1
  Bottom 0.203: IC4.22 18.8,49.89 18.8,50.7 19.41,51.31 27.53,51.31 36.07,42.77 36.07,28.25 37.69,26.62 37.69,23.16 29.06,14.53 B2.2
GPA2  (via drill 0.3)
  Top 0.203: v39.42,12.39 41.45,14.43 B3.2
  Bottom 0.203: v39.42,12.39 26.31,12.39 21.95,16.76 16.46,16.76 12.19,21.03 12.19,50.49 13.82,52.12 16.56,52.12 17.98,50.7 17.98,49.89 IC4.23
GPA3
  Bottom 0.203: IC4.24 17.37,49.89 17.37,50.7 16.36,51.71 14.02,51.71 12.6,50.29 12.6,21.23 16.66,17.17 22.15,17.17 26.31,13.01 52.53,13.01 53.95,14.43 B4.2
GPA4  (via drill 0.3)
  Top 0.203: v16.76,46.94 16.76,46.63 1.73,31.6 1.73,15.95 7.92,9.75 61.77,9.75 66.45,14.43 B5.2
  Bottom 0.203: v16.76,46.94 16.76,49.78 IC4.25
GPA5
  Bottom 0.203: IC4.26 16.05,49.89 16.05,50.7 15.44,51.31 14.22,51.31 13.01,50.09 13.01,21.44 16.87,17.58 22.35,17.58 26.52,13.41 49.38,13.41 51.61,15.65 58.42,15.65 60.66,13.41 77.93,13.41 78.94,14.43 B6.2
GPA6
  Bottom 0.203: IC4.27 15.44,49.89 15.44,50.7 15.24,50.9 14.43,50.9 13.41,49.89 13.41,36.58 16.46,33.53 B7.2
GPA7
  Bottom 0.203: IC4.28 14.83,49.78 14.83,47.75 24.38,38.2 24.38,37.8 28.65,33.53 28.96,33.53 B8.2
GPB0  (via drill 0.46)
  Top 0.406: v14.02,56.69 18.29,56.69 21.84,60.25 23.27,60.25 27.03,56.49 27.03,52.22 31.09,48.16 v31.7,48.16 | v37.59,38.51 38.51,38.51 41.45,35.56 41.45,33.53 B9.2
  Bottom 0.406: v14.02,56.69 14.33,57 14.73,57 IC4.1 | v31.7,48.16 31.7,47.95 37.59,42.06 v37.59,38.51
GPB1
  Bottom 0.203: IC4.2 15.54,57 15.54,56.19 18.59,53.14 28.04,53.14 38.3,42.88 38.3,36.78 38.61,36.47 51.82,36.47 53.95,34.34 53.95,33.53 B10.2
GPB2
  Bottom 0.203: IC4.3 16.15,57 16.15,56.29 18.9,53.54 36.88,53.54 43.99,46.43 55.17,46.43 66.45,35.15 66.45,33.53 B11.2
GPB3  (via drill 0.3)
  Top 0.203: v21.95,55.37 v18.69,55.37 | v74.57,38 79.05,33.53 B12.2
  Bottom 0.203: v18.69,55.37 17.68,55.37 16.87,56.19 16.87,57 IC4.4 | v21.95,55.37 33.73,55.37 34.34,54.76 57.81,54.76 v74.57,38
GPB4  (via drill 0.3)
  Top 0.203: v98.86,12.5 100.79,14.43 B13.2
  Bottom 0.203: v98.86,12.5 93.78,7.42 20.02,7.42 10.97,16.46 10.97,54.66 14.53,58.22 17.07,58.22 17.37,57.91 17.37,57.1 IC4.5
GPB5
  Bottom 0.203: IC4.6 18.09,57.1 18.09,59.03 27.03,67.97 80.06,67.97 80.87,67.16 80.87,62.79 80.67,62.59 80.67,55.78 98.35,38.1 B14.2
GPB6
  Bottom 0.203: IC4.7 18.8,57 18.8,56.19 21.03,53.95 40.03,53.95 41.45,52.53 B15.2
GPB7
  Bottom 0.203: IC4.8 19.41,57 19.41,56.29 21.34,54.36 52.12,54.36 53.95,52.53 B16.2
I2C_SCL  (via drill 0.3)
  Top 0.203: v97.54,21.34 93.78,25.09 v90.53,25.09 90.53,27.53 79.45,38.61 47.45,38.61 | v49.78,29.97 49.78,31.5 47.45,33.83 47.45,38.61 | 47.45,38.61 47.45,42.57 v34.14,55.88
  Bottom 0.203: v90.53,25.09 89.31,25.09 R2.1 | v97.54,21.34 100.38,18.49 101.09,18.49 JP4.2 | v49.78,29.97 49.68,29.97 46.33,26.62 46.33,25.3 IC3.26 | v34.14,55.88 22.35,55.88 22.05,56.19 22.05,57 IC4.12
I2C_SDA  (via drill 0.3)
  Top 0.203: v90.53,24.18 46.63,24.18 | 46.63,24.18 v46.02,24.18 | v23.37,58.42 23.37,52.22 33.93,41.66 45.92,41.66 46.63,40.95 46.63,24.18
  Bottom 0.203: v46.02,24.18 45.72,24.49 45.72,25.2 IC3.27 | v90.53,24.18 91.54,25.2 R1.1 91.44,25.2 90.53,26.11 88.59,26.11 88.39,25.91 88.39,22.76 88.59,22.55 93.78,22.55 97.84,18.49 98.55,18.49 JP4.1 | v23.37,58.42 23.16,58.42 22.66,57.91 22.66,57.1 IC4.13
L0
  Top 0.203: 19.76,13.77 20.42,14.43 B1.L1 | 19.76,13.77 19.71,13.72 19.71,11.07 R37.1 | 19.76,13.77 19.1,14.43 18.59,14.43 B1.L2
L1
  Top 0.203: R36.1 32.82,11.18 32.82,14.33 32.92,14.43 B2.L1 32.82,14.43 31.09,14.43 B2.L2
L2
  Top 0.203: R35.1 45.41,11.18 45.41,14.43 B3.L1 45.31,14.43 43.59,14.43 B3.L2
L3
  Top 0.203: R34.1 57.81,11.18 57.81,14.33 57.91,14.43 B4.L1 57.81,14.43 56.08,14.43 B4.L2
L4
  Top 0.203: R33.1 70.31,11.18 70.31,14.33 70.41,14.43 B5.L1 70.31,14.43 68.58,14.43 B5.L2
L5
  Top 0.203: R32.1 82.7,11.18 82.7,14.22 82.91,14.43 B6.L1 82.8,14.43 81.08,14.43 B6.L2
L6
  Top 0.203: R31.1 20.22,29.87 20.22,33.22 20.42,33.43 B7.L1 20.32,33.43 18.59,33.43 B7.L2
L7
  Top 0.203: R30.1 35.76,29.36 35.76,30.68 33.02,33.43 B8.L1 32.92,33.53 31.09,33.53 B8.L2
L8
  Top 0.203: R29.1 45.41,29.67 45.41,33.43 B9.L1 45.31,33.43 43.59,33.43 B9.L2
L9
  Top 0.203: R28.1 57.71,29.77 57.71,33.22 57.91,33.43 B10.L1 57.81,33.43 56.08,33.43 B10.L2
L10
  Top 0.203: R27.1 70.71,29.77 70.71,33.22 70.51,33.43 B11.L1 70.41,33.53 68.58,33.53 B11.L2
L11
  Top 0.203: 82.45,32.97 82.91,33.43 B12.L1 | 82.45,32.97 82.4,32.92 82.4,29.36 R26.1 | 82.45,32.97 81.99,33.43 81.08,33.43 B12.L2
L12
  Top 0.203: R25.1 97.13,11.28 99.67,11.28 102.82,14.43 B13.L2 102.92,14.53 104.85,14.53 B13.L1
L13
  Top 0.203: R24.1 98.45,30.28 98.45,33.93 B14.L1 98.35,34.04 98.35,35.97 B14.L2
L14
  Top 0.203: R23.1 45.72,48.87 45.72,52.22 45.52,52.43 B15.L1 45.41,52.53 43.59,52.53 B15.L2
L15
  Top 0.203: 57.45,51.97 57.91,52.43 B16.L1 | 57.45,51.97 57.4,51.92 57.4,48.87 R22.1 | 57.45,51.97 57,52.43 56.08,52.43 B16.L2
N$2  (via drill 0.3)
  Top 0.203: v38.91,37.08 38.91,35.36 37.59,34.04 37.59,29.36 R30.2
  Bottom 0.203: v38.91,37.08 55.98,37.08 59.13,33.93 59.13,33.12 58.42,32.41 53.65,32.41 52.83,31.6 52.83,31.09 IC3.13
N$7
  Bottom 0.203: R4.1 113.19,22.86 109.54,22.86 108.9,23.5 U$7.A2
N$11
  Bottom 0.203: R3.1 113.19,19.68 110.01,19.68 108.9,18.57 U$7.A3
N$19  (via drill 0.3)
  Top 0.203: v49.78,29.16 49.58,29.36 49.48,29.36 47.04,31.8 47.04,41.15 44.2,43.99 32.21,43.99 23.98,52.22 23.98,58.73 22.96,59.74 22.15,59.74 17.88,55.47 17.88,45.41 13.41,40.95 13.41,33.02 16.56,29.87 18.39,29.87 R31.2
  Bottom 0.203: v49.78,29.16 51.41,29.16 52.12,29.87 52.12,30.99 IC3.12
N$23  (via drill 0.3)
  Top 0.203: v54.46,26.82 v51.31,29.97 | v73.25,21.95 73.25,16.66 78.74,11.18 80.97,11.18 R32.2
  Bottom 0.203: v51.31,29.97 51.41,30.07 51.41,30.99 IC3.11 | v54.46,26.82 68.38,26.82 v73.25,21.95
N$31  (via drill 0.3)
  Top 0.203: v51.71,35.66 58.62,35.66 v68.38,25.91 | v71.63,20.83 71.63,19.81 70.71,18.9 70.71,15.85 71.63,14.94 71.63,10.97 70.92,10.26 69.39,10.26 68.58,11.07 R33.2
  Bottom 0.203: v51.71,35.66 50.9,34.85 50.9,31.09 IC3.10 | v68.38,25.91 68.38,25.2 71.63,21.95 v71.63,20.83
N$58  (via drill 0.3)
  Top 0.203: v50.19,32.61 50.19,33.22 51.61,34.65 58.42,34.65 61.98,31.09 v61.98,25.4 | v60.55,14.43 60.55,12.39 58.42,10.26 56.9,10.26 56.08,11.07 R34.2
  Bottom 0.203: v50.19,32.61 50.19,31.09 IC3.9 | v61.98,25.4 61.98,20.32 60.55,18.9 v60.55,14.43
N$59  (via drill 0.3)
  Top 0.203: v49.58,33.22 51.41,35.05 58.62,35.05 62.59,31.09 v62.59,24.79 | v63.09,19.2 63.09,16.56 62.18,15.65 51.41,15.65 46.02,10.26 44.5,10.26 43.69,11.07 R35.2
  Bottom 0.203: v49.58,33.22 49.58,31.09 IC3.8 | v62.59,24.79 62.59,19.71 v63.09,19.2
N$67  (via drill 0.3)
  Top 0.203: v45.62,26.82 43.28,26.82 34.14,17.68 34.14,10.97 33.43,10.26 32,10.26 31.19,11.07 R36.2
  Bottom 0.203: v45.62,26.82 48.87,30.07 48.87,30.99 IC3.7
N$74  (via drill 0.3)
  Top 0.203: v39.32,34.85 38.41,33.93 38.41,26.31 v34.24,22.15 | v25.81,15.65 20.32,10.16 18.8,10.16 17.98,10.97 R37.2
  Bottom 0.203: v39.32,34.85 40.54,36.07 49.89,36.07 50.19,35.76 50.19,35.15 48.26,33.22 48.26,31.09 IC3.6 | v34.24,22.15 34.24,21.23 28.65,15.65 v25.81,15.65
N$75  (via drill 0.3)
  Top 0.203: v55.78,25.2 60.96,25.2 v61.37,24.79 | v46.63,22.66 45.41,23.88 45.41,25.7 46.23,26.52 46.23,27.13 43.69,29.67 R29.2
  Bottom 0.203: v55.78,25.2 IC3.15 | v61.37,24.79 61.37,23.37 57.81,19.81 49.48,19.81 v46.63,22.66
N$76  (via drill 0.3)
  Top 0.203: v57.71,26.21 59.94,28.45 59.94,29.06 59.64,29.36 58.93,29.36 58.42,28.85 56.9,28.85 56.08,29.67 R28.2
  Bottom 0.203: v57.71,26.21 55.88,24.38 53.14,24.38 52.83,24.69 52.83,25.2 IC3.16
N$77  (via drill 0.3)
  Top 0.203: v52.63,26.21 56.79,26.21 v59.33,28.75 | v68.07,28.75 68.99,29.67 R27.2
  Bottom 0.203: v52.63,26.21 52.22,25.81 52.22,25.3 IC3.17 | v68.07,28.75 v59.33,28.75
N$78  (via drill 0.3)
  Top 0.203: v67.36,26.01 68.07,25.3 79.96,25.3 83.92,29.26 R26.2
  Bottom 0.203: v67.36,26.01 61.67,26.01 59.64,23.98 52.22,23.98 51.51,24.69 51.51,25.2 IC3.18
N$79  (via drill 0.3)
  Top 0.203: v50.9,22.25 50.9,21.03 55.07,16.87 v62.48,16.87 | v94.39,10.26 95.3,11.18 R25.2
  Bottom 0.203: v50.9,22.25 50.9,25.2 IC3.19 | v62.48,16.87 62.79,16.87 64.01,15.65 85.14,15.65 89.1,11.68 89.61,11.68 90.63,10.67 90.63,8.33 91.14,7.82 91.95,7.82 v94.39,10.26
N$80  (via drill 0.3)
  Top 0.203: v79.15,23.57 v50.19,23.57 | v87.27,31.7 95.3,31.7 96.72,30.28 R24.2
  Bottom 0.203: v50.19,23.57 IC3.20 | v87.27,31.7 v79.15,23.57
N$81  (via drill 0.3)
  Top 0.203: v55.68,31.8 v53.95,30.07 | v54.86,45.82 50.49,45.82 47.55,48.77 R23.2
  Bottom 0.203: v53.95,30.07 49.58,25.7 49.58,25.3 IC3.21 | v55.68,31.8 58.42,31.8 59.54,32.92 59.54,41.15 v54.86,45.82
N$82  (via drill 0.3)
  Top 0.203: v48.97,27.43 50.39,28.85 50.39,31.5 48.97,32.92 48.97,35.76 v51.21,38 | v57.3,42.47 57.3,47.14 58.93,48.77 R22.2
  Bottom 0.203: v48.97,27.43 48.97,25.3 IC3.22 | v51.21,38 57,38 59.13,40.13 59.13,40.95 57.61,42.47 v57.3,42.47
RES
  Bottom 0.203: RESETA.1 107,25.24 106.68,25.24 99.54,32.38 99.54,54.29 87.31,66.52 GND.RES
SLIDER_IN
  Bottom 0.203: 75.29,55.68 74.98,55.68 73.66,54.36 POT1.2A | 75.29,55.68 75.79,55.68 C7.1 | 75.29,55.68 75.29,58.32 69.49,64.11 69.49,66.65 GND.A0

### Text on the board
_tsilk: SCL SDA
_bsilk: SKAARHOJ 2015 | v06-15 | PCB-CMB-5-ETHERMEGA | GITHUB: SKAARHOJ-Open-Engineering | I2C PullUps